# EAGLE design AND (EAGLE 7.4.0)
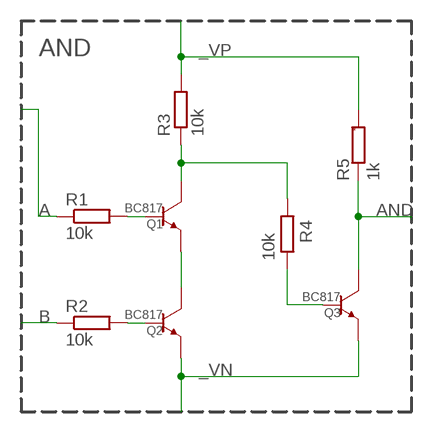
[diagram p0: schematic, sheet 1]

## Parts
Q1  BC817  TRANSISTOR-NPN-GENERICDEFAULT-SOT23-BEC  [SOT23]
Q2  BC817  TRANSISTOR-NPN-GENERICDEFAULT-SOT23-BEC  [SOT23]
Q3  BC817  TRANSISTOR-NPN-GENERICDEFAULT-SOT23-BEC  [SOT23]
R1  10k  R-EU_R0603  [R0603]
R2  10k  R-EU_R0603  [R0603]
R3  10k  R-EU_R0603  [R0603]
R4  10k  R-EU_R0603  [R0603]
R5  1k  R-EU-MARKEDR0603  [R0603-MARK]

## Nets
_VN: Q2.P$2(EMITTER) Q3.P$2(EMITTER)
_VP: R3.2 R5.2
A: R1.1
AND: Q3.P$3(COLLECTOR) R5.1
B: R2.1
N$1: Q1.P$1(BASE) R1.2
N$2: Q1.P$3(COLLECTOR) R3.1 R4.2
N$3: Q2.P$1(BASE) R2.2
N$5: Q1.P$2(EMITTER) Q2.P$3(COLLECTOR)
N$15: Q3.P$1(BASE) R4.1

## Notes on the sheet
- AND

## Library data of the parts
Q1-Q3 = p.peter-gator:TRANSISTOR-NPN-GENERIC; SV_SPICE_MODEL: NPN (); SV_SPICE_ORDER: COLLECTOR;BASE;EMITTER; SV_SPICE_PREFIX: Q
R1-R4 = p.peter-gator:R-EU_: RESISTOR, European symbol; SV_SPICE_ORDER: 1;2; SV_SPICE_PREFIX: R
R5 = p.peter-rcl:R-EU-MARKED

## Board
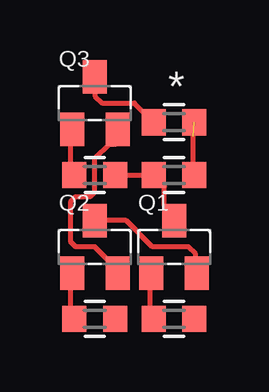
[diagram p1: board, top side]
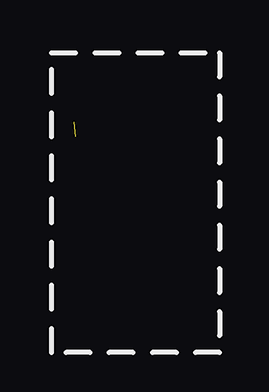
[diagram p2: board, bottom side, seen from below]

No outline drawn. Coordinates in mm, seen from the top.
Copper layers (1*16): Top 0.0356mm / dielectric 1.5011mm / Bottom 0.0356mm
Design rules "oshpark": minimum track width 6mil, minimum drill 13mil, track to track 6mil, track to pad 6mil, pad to pad 6mil, via to via 6mil, smd to smd 6mil, copper to edge 15mil, drill to drill 6mil, minimum pad ring 7mil, minimum via ring 7mil, stop-mask expansion 4mil, vias tented up to drill 4.1mm, thermal gap 10mil

### Footprints (pad centres in the part's own frame; a part is rotated, then mirrored left to right if it is on the bottom)
SOT23 = smd 1 x 1.4: P$1 -0.95,-1.1; P$2 0.95,-1.1; P$3 0,1.1
R0603 = smd 1 x 1.1: 1 -0.85,0; 2 0.85,0

### Placement (x,y rotation side)
Q1  5.2,4.4 0 top
Q2  1.9,4.4 0 top
Q3  1.9,10.4 0 top
R1  5.2,1.4 180 top
R2  1.9,1.4 180 top
R3  5.2,7.4 0 top
R4  1.9,7.4 0 top
R5  1k  [R0603]  5.2,9.6 0 top

### Tracks (layer width: path | path; a pad name or v marks a point on that pad's centre or on a via)
_VN
  Top 0.2: Q2.P$2 2.8,3.3 2.8,3.4 2.8,3.5 1.9,4.4 1.1,4.4 0.9,4.6 0.9,6.3 1.1,6.5 1.7,6.5 1.9,6.7 1.9,8.1 2.5,8.7 2.8,8.7 2.85,8.75 Q3.P$2
_VP  (1 unrouted)
  Top 0.2: R3.2 6.1,7.4 6,7.5 6,9 | 6,9.6 R5.2
AND
  Top 0.2: 4,9.95 R5.1 3.55,10.4 2.2,10.4 1.9,10.7 Q3.P$3
B
  Top 0.2: R2.1 2.8,1.4 3,1.3
N$1
  Top 0.2: R1.2 4.3,1.4 4.2,1.5 4.2,3.25 Q1.P$1
N$2
  Top 0.2: R3.1 4.4,7.4 R3.1 | R3.1 4.7,7.05 4.7,7 4.8,6.9 4.8,6.1 4.9,6 5.2,5.7 Q1.P$3 | R4.2 R3.1
N$3
  Top 0.2: R2.2 0.9,1.4 0.9,3.25 Q2.P$1
N$5
  Top 0.2: Q1.P$2 6.1,3.3 6.1,4.1 5.8,4.4 4.3,4.4 3.2,5.5 Q2.P$3
N$15
  Top 0.2: Q3.P$1 0.9,9.25 0.9,7.4 R4.1

### Text on the board
tPlace: *